# EAGLE design Crowtail- LoRa RA-08H-V1.2 (EAGLE 9.5.1)
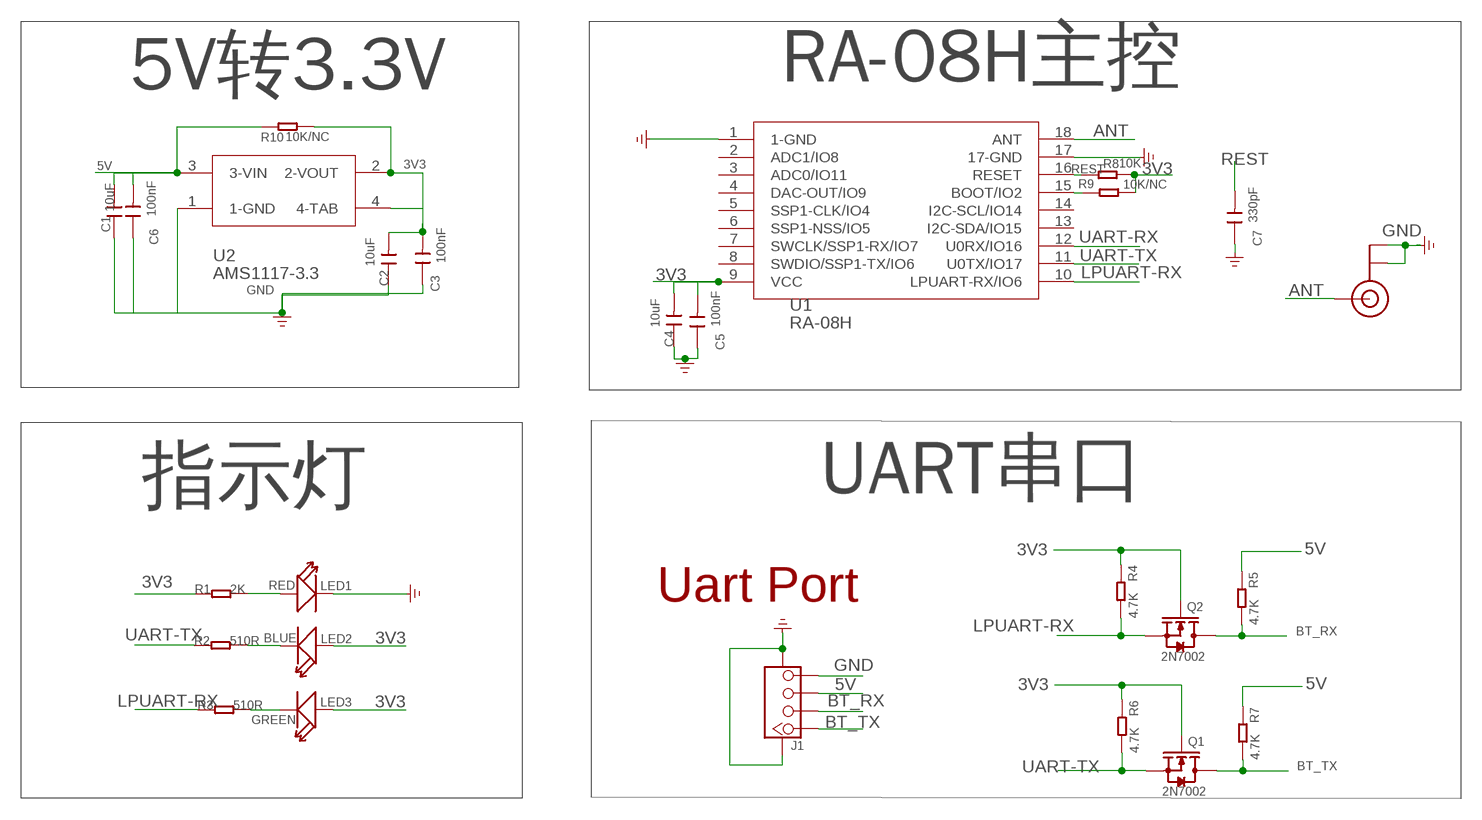
[diagram p0: schematic, sheet 1]

## Parts
C1  10uF  C-0805  [C0805]
C2  10uF  C-0805  [C0805]
C3  100nF  C-0603  [C0603]
C4  10uF  C-0805  [C0805]
C5  100nF  C-0603  [C0603]
C6  100nF  C-0603  [C0603]
C7  330pF  C-0603  [C0603]
J1  TWIG-4P-2.0-SMD-FEMALE-REINFORCE'90D'  [4P-SMD-2.0-90D]
J2  U.FL  [U.FL]
LED1  RED  LED'0603'  [LED-0603]
LED2  BLUE  LED'0603'  [LED-0603]
LED3  GREEN  LED'0603'  [LED-0603]
Q1  2N7002  MOSFET-N'SOT23'  [SOT23]
Q2  2N7002  MOSFET-N'SOT23'  [SOT23]
R1  2K  R-0603  [0603]
R2  510R  R-0603  [0603]
R3  510R  R-0603  [0603]
R4  4.7K  DISCRETE_R-0603  [DISCRETE_R0603]
R5  4.7K  DISCRETE_R-0603  [DISCRETE_R0603]
R6  4.7K  DISCRETE_R-0603  [DISCRETE_R0603]
R7  4.7K  DISCRETE_R-0603  [DISCRETE_R0603]
R8  10K  DISCRETE_R-0603  [DISCRETE_R0603]
R9  10K/NC  DISCRETE_R-0603  [DISCRETE_R0603]
R10  10K/NC  DISCRETE_R-0603  [DISCRETE_R0603]
U1  RA-08H  [RA-08H-SMD-18]
U2  AMS1117-3.3  [AMS1117-3.3-SOT223]

## Nets
3V3: C2.2 C3.2 C4.2 C5.2 LED2.+ LED3.+ Q1.1(G) Q2.1(G) R1.1 R4.1 R6.1 R8.2 R9.2 R10.2 U1.9(VCC) U2.2(2-VOUT) U2.4(4-TAB)
5V: C1.2 C6.2 J1.3 R5.1 R7.1 R10.1 U2.3(3-VIN)
ANT [line]: J2.P$3(SIGNAL) U1.18(ANT)
BT_RX: J1.2 Q2.3(D) R5.2
BT_TX: J1.1 Q1.3(D) R7.2
GND: C1.1 C2.1 C3.1 C4.1 C5.1 C6.1 C7.1 J1.4 J1.SS1 J1.SS2 J2.P$1(GND) J2.P$2(GND) LED1.- U1.1(1-GND) U1.17(17-GND) U2.1(1-GND)
LPUART-RX: Q2.2(S) R3.1 R4.2 U1.10(LPUART-RX/IO6)
N$1: LED2.- R2.2
N$2: LED1.+ R1.2
N$3: LED3.- R3.2
N$8: R9.1 U1.15(BOOT/IO2)
REST: C7.2 R8.1 U1.16(RESET)
UART-RX: U1.12(U0RX/IO16)
UART-TX: Q1.2(S) R2.1 R6.2 U1.11(U0TX/IO17)
Unconnected: U1.2(ADC1/IO8) U1.3(ADC0/IO11) U1.4(DAC-OUT/IO9) U1.5(SSP1-CLK/IO4) U1.6(SSP1-NSS/IO5) U1.7(SWCLK/SSP1-RX/IO7) U1.8(SWDIO/SSP1-TX/IO6) U1.13(I2C-SDA/IO15) U1.14(I2C-SCL/IO14)

## Notes on the sheet
- 5V转3.3V | RA-08H主控
- 指示灯 | UART串口
- Uart Port

## Library data of the parts
C1-C7 = Discrete:C*: Ceramic Capacitors
J1 = Connector:TWIG-4P-2.0-SMD-FEMALE-REINFORCE
J2 = SparkFun2:U.FL
LED1-LED3 = Discrete:LED*
Q1 Q2 = discrete:MOSFET-N: IRLL014: http://www.vishay.com/docs/91319/sihll014.pdf
R1-R3 = Discrete:R*
R4-R10 = Crowtail-_LED-V2.0-20190615-01:DISCRETE_R*
U1 = Crowtail- LoRA module-V1.0:RA-08H
U2 = Crowtail- LoRA module-V1.0:AMS1117-3.3

## Net classes
1 line: clearance 0.406 mm

## Board
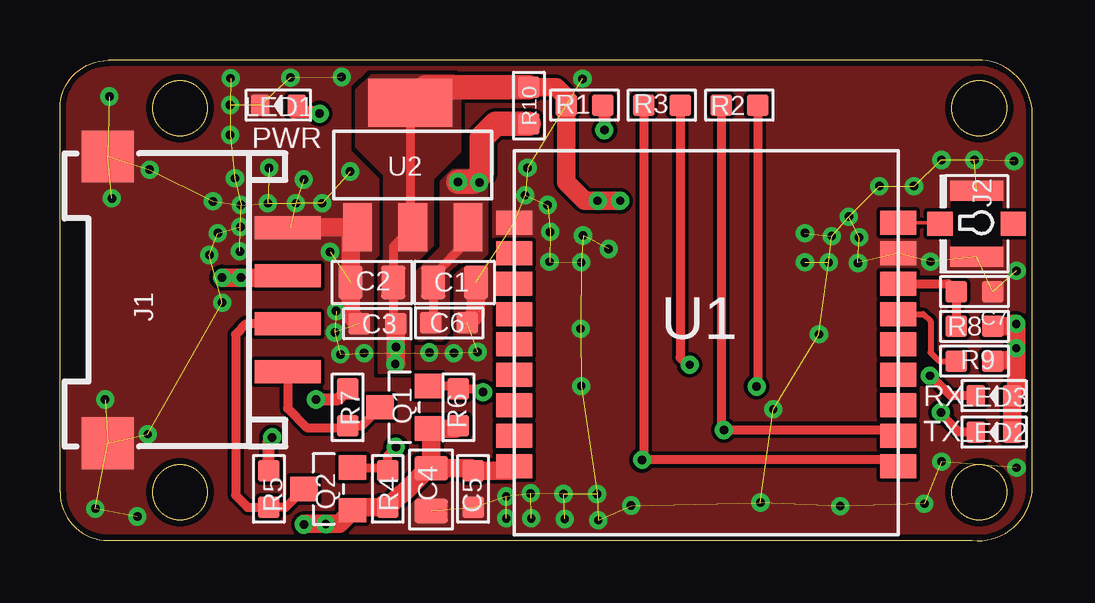
[diagram p1: board, top side]
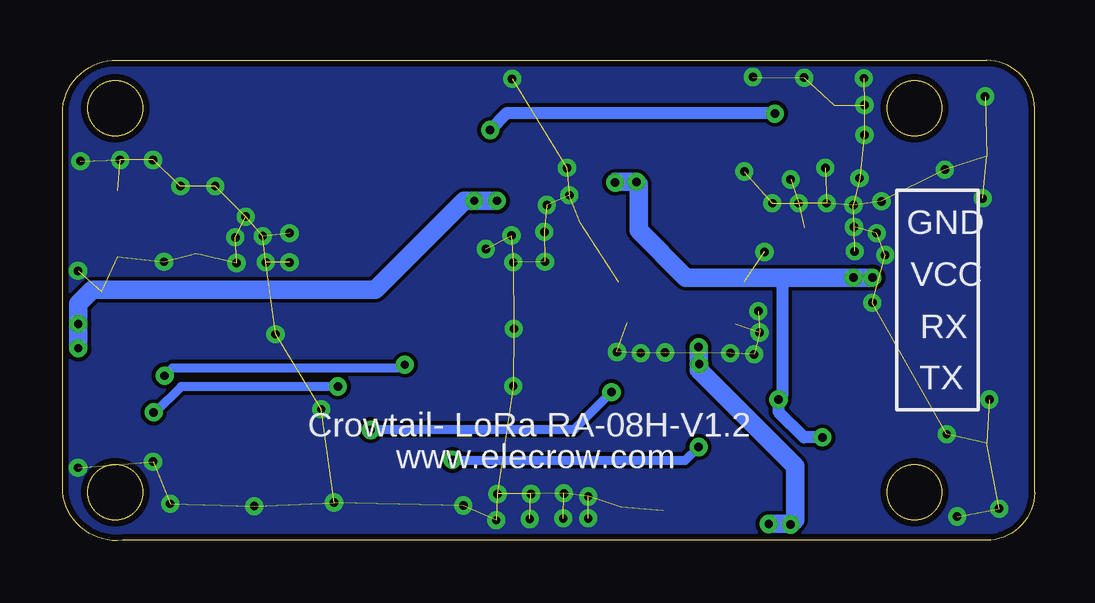
[diagram p2: board, bottom side, seen from below]

Size 40.5 x 20.03 mm. Coordinates in mm from the lower left corner, seen from the top.
Outline: 0,2.01 0,18.01 arc-90 2,20.01 38,20.01 arc-90 40.5,18.01 40.5,2.01 arc-90 38,0.01 2,0.01 arc-90 0,2.01
Outline: circle at 5,18.01 radius 1.14
Outline: circle at 5,2.01 radius 1.14
Outline: circle at 38.3,18.01 radius 1.14
Outline: circle at 38.3,2.01 radius 1.14
Copper layers (1*16): Top 0.035mm / dielectric 1.5mm / Bottom 0.035mm
Design rules "default *": minimum track width 6mil, minimum drill 0.35mm, track to track 6mil, track to pad 6mil, pad to pad 6mil, via to via 6mil, smd to smd 6mil, copper to edge 10mil, drill to drill 6mil, minimum pad ring 10mil, minimum via ring 8mil, stop-mask expansion 4mil, vias tented up to drill 100mil, thermal gap 10mil
tRestrict: area 37.2,12.3 to 39.2,14.1

### Footprints (pad centres in the part's own frame; a part is rotated, then mirrored left to right if it is on the bottom)
C0805 = smd 1.016 x 1.397: 1 -0.889,0; 2 0.889,0
C0603 = smd 0.889 x 0.889: 1 -0.762,0; 2 0.762,0
4P-SMD-2.0-90D = smd 0.965 x 2.74: 1 -3,-0.1; 2 -1,-0.1; 3 1,-0.1; 4 3,-0.1 | smd 2.159 x 2.184: SS1 -5.974,7.4; SS2 5.974,7.4
U.FL = smd 2.2 x 0.85: P$1 0,1.375; P$2 0,-1.375 | smd 1.05 x 1: P$3 1.525,0; P$4 -1.525,0
LED-0603 = smd 0.762 x 0.889: + -0.762,0; - 0.762,0
SOT23 = smd 1.016 x 1.143: 1 -0.889,-1.016; 2 0.889,-1.016; 3 0,1.016
0603 = smd 0.889 x 0.889: 1 -0.762,0; 2 0.762,0
DISCRETE_R0603 = smd 0.889 x 0.889: 1 -0.762,0; 2 0.762,0
RA-08H-SMD-18 = smd 1.5 x 1: 1 -8.4,5.1; 2 -8.4,3.83; 3 -8.4,2.56; 4 -8.4,1.29; 5 -8.4,0.02; 6 -8.4,-1.25; 7 -8.4,-2.52; 8 -8.4,-3.79; 9 -8.4,-5.06; 10 7.61,-5.06; 11 7.61,-3.79; 12 7.61,-2.52; 13 7.61,-1.25; 14 7.61,0.02; 15 7.61,1.29; 16 7.61,2.56; 17 7.61,3.83; 18 7.6,5.1
AMS1117-3.3-SOT223 = smd 1.2 x 2: 1 -2.2,-2.7; 2 0.1,-2.7; 3 2.4,-2.7 | smd 3.5 x 2: 4 0,2.5

### Placement (x,y rotation side)
C1  16.44,10.76 180 top
C2  13,10.76 0 top
C3  13.23,9.04 0 top
C4  15.46,2.13 90 top
C5  17.21,2.15 90 top
C6  16.21,9.07 180 top
C7  38.1,10.38 180 top
J1  9.39,10.03 90 top
J2  38.19,13.2 180 top
LED1  9.1,18.14 180 top
LED2  38.92,4.52 180 top
LED3  38.92,6.04 180 top
Q1  14.34,5.56 90 top
Q2  11.18,2.15 90 top
R1  21.85,18.14 0 top
R2  28.31,18.14 0 top
R3  25.08,18.14 0 top
R4  13.66,2.15 90 top
R5  8.7,2.15 270 top
R6  16.6,5.56 90 top
R7  11.98,5.56 270 top
R8  38.1,8.93 0 top
R9  38.1,7.48 0 top
R10  19.53,18.12 90 top
U1  27.32,8.15 0 top
U2  14.6,15.75 0 top

### Tracks (layer width: path | path; a pad name or v marks a point on that pad's centre or on a via)
3V3  (via drill 0.35)
  Top 0.381: U2.4 14.6,13.15 U2.2 13.89,12.24 C2.2 13.89,9.15 C3.2
  Top 0.762: 38.89,7.5 R9.2 38.89,7.51 39.77,7.51 39.84,7.43 | C4.2 17.11,3.02 C5.2 18.74,2.91 U1.9 | R6.1 16.48,4.67 Q1.1 15.46,4.57 C4.2 | U2.4 15.26,18.91 | C3.2 v13.99,8.07 v14,8.06 14,7.38 v13.97,7.35 | C4.2 15.34,3.02 14.26,1.94 14.2,1.94 R4.1 12.32,1.39 Q2.1 11.63,0.7 10.19,0.7 v10.16,0.67 | R8.2 39.61,8.93 39.72,9.03 v39.84,9.03 39.84,7.43 | R10.2 20.68,18.89 21.09,18.47 R1.1 21.09,14.94 21.87,14.16 v23.34,14.16 | 39.84,7.43 39.84,6.2 LED3.+ LED2.+
  Top 1.016: R10.2 15.23,18.89 U2.4
  Bottom 0.762: v14,8.06 14,7.13 9.96,3.09 9.96,0.87 v10.16,0.67 10.18,0.7 v11.07,0.7 | v22.4,14.16 v23.34,14.16 23.76,14.16 27.47,10.45 39.26,10.45 39.84,9.87 v39.84,9.03 v39.84,8.01
  pour Top (no thermals): 12.98,19.37 16.38,19.37 16.66,19.09 16.66,16.22 15.52,15.08 15.52,12.31 14.55,11.34 14.55,7.02 13.31,7.02 13.31,11.49 13.54,11.72 13.54,15.25 12.37,16.42 12.37,18.76
5V  (via drill 0.35)
  Top 0.381: U2.3 17,12.49 15.55,11.04 C1.2 15.55,9.17 C6.2
  Top 0.508: R5.1 8.7,4.17 v8.84,4.31 | v7.54,10.96 7.62,11.03 J1.3 | R7.1 11.54,5.88 v10.67,5.88
  Top 0.762: J1.3 9.42,10.96 v6.76,10.96
  Top 1.016: v16.59,14.95 17.22,14.95 17.58,15.3 17.58,16.78 18.16,17.36 R10.1
  Bottom 0.508: v8.84,4.31 9.6,4.31 10.67,5.37 v10.67,5.88 10.52,6.03 10.52,10.88 10.44,10.96 v7.54,10.96
  Bottom 0.762: v7.54,10.96 v6.76,10.96 14.53,10.96 16.5,12.93 16.5,14.86 v16.59,14.95 17.45,14.95 v17.48,14.92
  pour Top (no thermals): 15.88,14.95 16.36,15.43 17.78,15.43 17.78,11.98 17.42,11.62 16.59,11.62 16.18,11.21 16.18,8.67 15.88,8.37 14.99,8.37 14.86,8.5 14.86,11.19 15.88,12.21
ANT
  Top 0.152: U1.18 36.62,13.25 J2.P$3
  Top 0.381: U1.18
BT_RX
  Top 0.381: Q2.3 9.4,1.39 R5.2 7.82,1.39 7.32,1.89 7.32,8.6 7.75,9.03 J1.2
BT_TX
  Top 0.381: R7.2 12.12,4.79 | 12.12,4.79 12.56,4.79 Q1.3 | J1.1 9.49,5.51 10.29,4.71 12.03,4.71 12.12,4.79
GND  (via drill 0.35)  (86 unrouted)
  Top 0.762: C3.1 12.11,9.4 C2.1 12.11,12.76 U2.1 9.51,13.05 J1.4 9.59,13.03 | C1.1 17.33,9.43 C6.1
  other vias: 11.25,12.03 11.68,7.76 12.67,7.81 15.39,7.84 16.41,7.81 17.4,7.86 19.38,14.39 20.42,12.87 19.48,15.53 21.77,19.24 32.16,12.69 34.14,14.77 36.73,15.86 38.1,15.86 39.75,15.81 39.85,3.04 36.73,3.29 35.59,14.77 18.59,1.84 19.61,1.97 18.59,0.93 19.63,0.93 20.98,1.94 21.03,0.9 22.43,0.85 22.38,1.94 20.32,13.98 9.83,14.06 8.66,14.06 7.54,13.98 7.49,12.05 10.92,14.06 7.52,13.07 11.51,9.56 11.46,8.67 2.16,14.26 1.88,5.88 6.76,9.92 6.22,11.9 36.27,11.62 22.86,12.15 29.72,5.47 20.4,11.62 23.8,1.46 29.18,1.59 32.51,1.44 36.02,1.54 9.6,19.29 7.11,19.27 2.06,18.5 1.47,1.33 3.23,1 3.66,4.43 39.85,11.24 21.69,8.83 21.72,6.44 31.04,11.6 32.03,11.6 33.25,11.57 33.3,12.64 31.04,12.82 32.87,13.5 7.29,15.1 6.38,14.14 6.58,12.82 3.73,15.46 21.72,11.6 12.09,15.38 31.62,8.6 21.79,12.71 10.16,15.05 8.71,15.53 11.73,19.32 7.09,18.15 7.09,16.9
  pour Bottom (rank 2): -4.04,23.13 47.65,23.13 47.65,-3.69 -5,-3.69 -7.62,-1.08 -7.62,19.55
  pour Top (rank 2, no thermals): -3.73,22.82 48.39,22.82 48.39,-4 -4.7,-4 -7.32,-1.38 -7.32,19.24
LPUART-RX  (via drill 0.35)
  Top 0.381: Q2.2 13.53,3.04 R4.2 13.66,3.56 v14,3.9 | U1.10 34.66,3.37 v24.26,3.37 24.32,3.43 R3.1
  Bottom 0.381: v14,3.9 14.55,3.34 24.23,3.34 v24.26,3.37
N$1  (via drill 0.35)
  Top 0.381: R2.2 29.07,6.46 v29.02,6.42 | LED2.- 37.47,4.52 36.7,5.28 v36.7,5.35
  Bottom 0.381: v29.02,6.42 35.55,6.42 36.63,5.35 v36.7,5.35
N$2  (via drill 0.35)
  Top 0.508: R1.2 22.68,18.08 v22.68,17.11 | v10.82,17.79 10.77,17.84 9.73,17.84 9.86,17.98 LED1.+
  Bottom 0.508: v22.68,17.11 21.97,17.82 10.85,17.82 v10.82,17.79
N$3  (via drill 0.35)
  Top 0.381: R3.2 25.84,7.62 26.14,7.33 v26.24,7.33 | LED3.- 37.11,6.04 36.28,6.87 v36.25,6.87
  Bottom 0.381: v26.24,7.33 26.37,7.2 35.92,7.2 v36.25,6.87
N$8
  Top 0.254: 35.38,9.44 U1.15 35.96,9.44 36.27,9.13 36.27,7.84 36.63,7.48 R9.1
  Top 0.381: 34.9,9.41 U1.15
REST
  Top 0.381: U1.16 37.01,10.71 C7.2 R8.1
UART-RX
  Top 0.381: U1.12 34.91,5.65
UART-TX  (via drill 0.35)
  Top 0.381: Q1.2 16.48,6.45 R6.2 17.49,6.32 v17.63,6.19 | U1.11 34.68,4.61 v27.66,4.61 27.54,4.73 R2.1
  Bottom 0.381: v17.63,6.19 19.18,4.64 27.64,4.64 v27.66,4.61

### Text on the board
tPlace: PWR | RX | TX
bPlace: GND | VCC | RX | TX | Crowtail- LoRa RA-08H-V1.2 | www.elecrow.com
tNames: J2